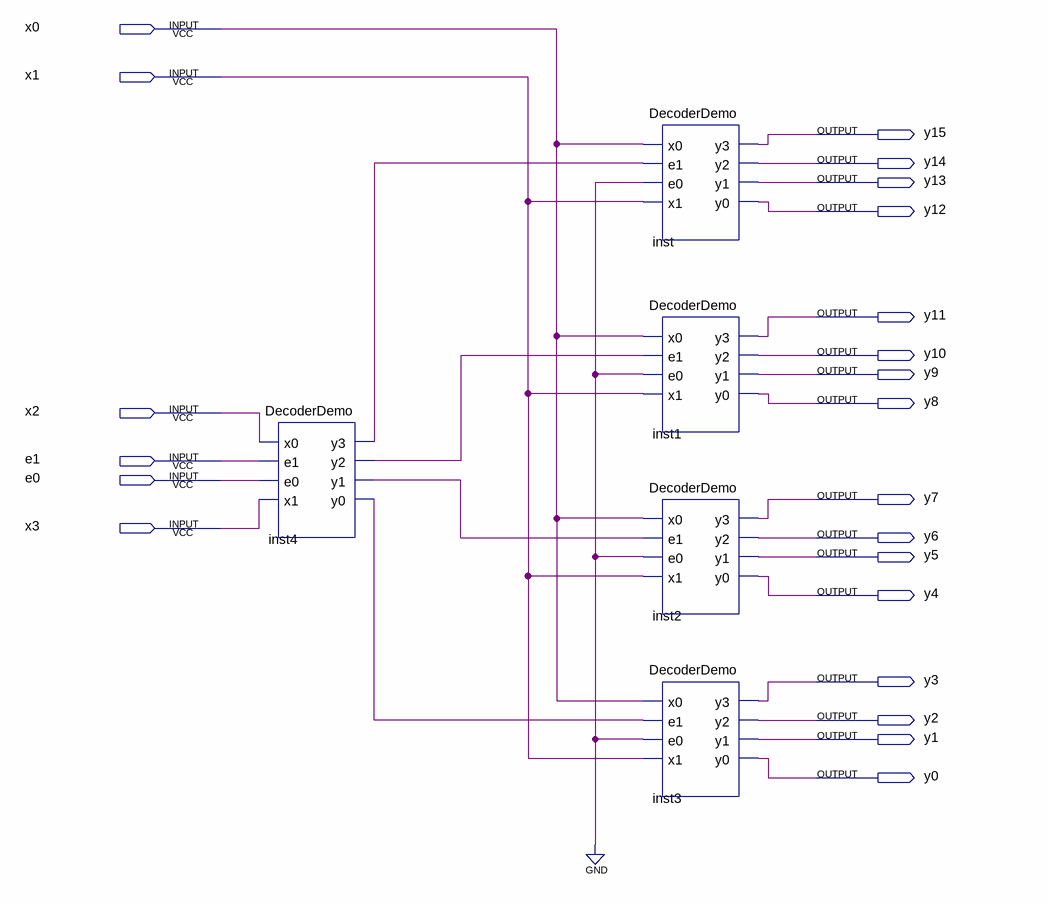
[diagram p0: schematic sheet]
// Quartus schematic Dec4_16.bdf as structural Verilog: 5 symbols, 22 pins
module Dec4_16 (
  input  x0,
  input  x1,
  input  x2,
  input  e1,
  input  e0,
  input  x3,
  output y15,
  output y14,
  output y13,
  output y12,
  output y11,
  output y10,
  output y9,
  output y8,
  output y7,
  output y6,
  output y5,
  output y4,
  output y3,
  output y2,
  output y1,
  output y0
);

  wire inst4_y0, inst4_y1, inst4_y2, inst4_y3;

  DecoderDemo inst4 (.x0(x2), .e1(e1), .e0(e0), .x1(x3), .y3(inst4_y3), .y2(inst4_y2), .y1(inst4_y1), .y0(inst4_y0));
  DecoderDemo inst (.x0(x0), .e1(inst4_y3), .e0(1'b0), .x1(x1), .y3(y15), .y2(y14), .y1(y13), .y0(y12));
  DecoderDemo inst1 (.x0(x0), .e1(inst4_y2), .e0(1'b0), .x1(x1), .y3(y11), .y2(y10), .y1(y9), .y0(y8));
  DecoderDemo inst2 (.x0(x0), .e1(inst4_y1), .e0(1'b0), .x1(x1), .y3(y7), .y2(y6), .y1(y5), .y0(y4));
  DecoderDemo inst3 (.x0(x0), .e1(inst4_y0), .e0(1'b0), .x1(x1), .y3(y3), .y2(y2), .y1(y1), .y0(y0));
endmodule
